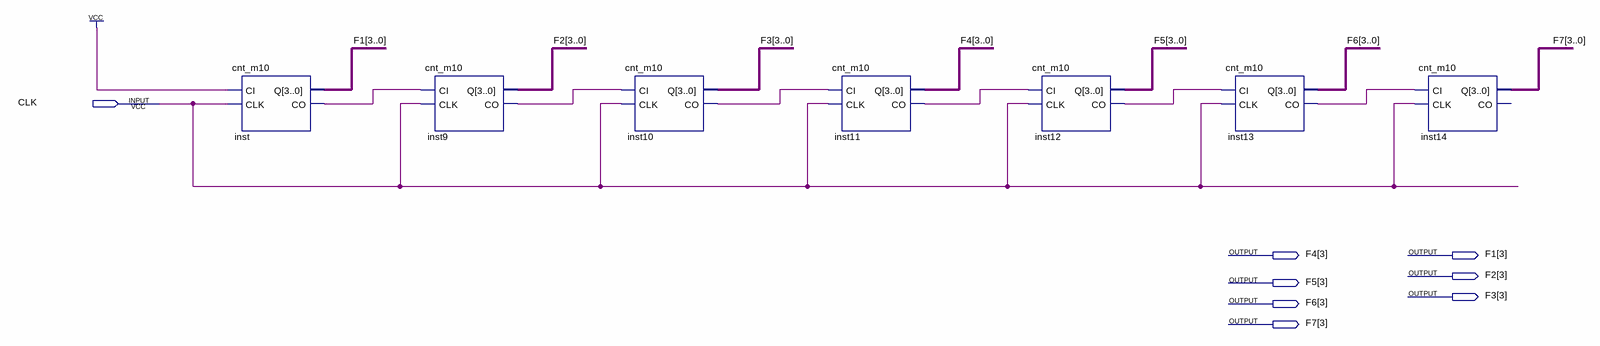
[diagram p0: schematic sheet]
// Quartus schematic EXP1.bdf as structural Verilog: 7 symbols, 8 pins
module EXP1 (
  input  CLK,
  output [3:0] F4,
  output [3:0] F1,
  output [3:0] F2,
  output [3:0] F5,
  output [3:0] F3,
  output [3:0] F6,
  output [3:0] F7
);

  wire inst9_co, inst10_co, inst11_co, inst12_co, inst13_co, inst_co;

  cnt_m10 inst (.CI(1'b1), .CLK(CLK), .Q(F1), .CO(inst_co));
  cnt_m10 inst9 (.CI(inst_co), .CLK(CLK), .Q(F2), .CO(inst9_co));
  cnt_m10 inst10 (.CI(inst9_co), .CLK(CLK), .Q(F3), .CO(inst10_co));
  cnt_m10 inst11 (.CI(inst10_co), .CLK(CLK), .Q(F4), .CO(inst11_co));
  cnt_m10 inst12 (.CI(inst11_co), .CLK(CLK), .Q(F5), .CO(inst12_co));
  cnt_m10 inst13 (.CI(inst12_co), .CLK(CLK), .Q(F6), .CO(inst13_co));
  cnt_m10 inst14 (.CI(inst13_co), .CLK(CLK), .Q(F7));  // open: CO
endmodule
